# Altium project Guitar_Synth_Pedal_Rev3.PrjPcb (part 1 of 2)
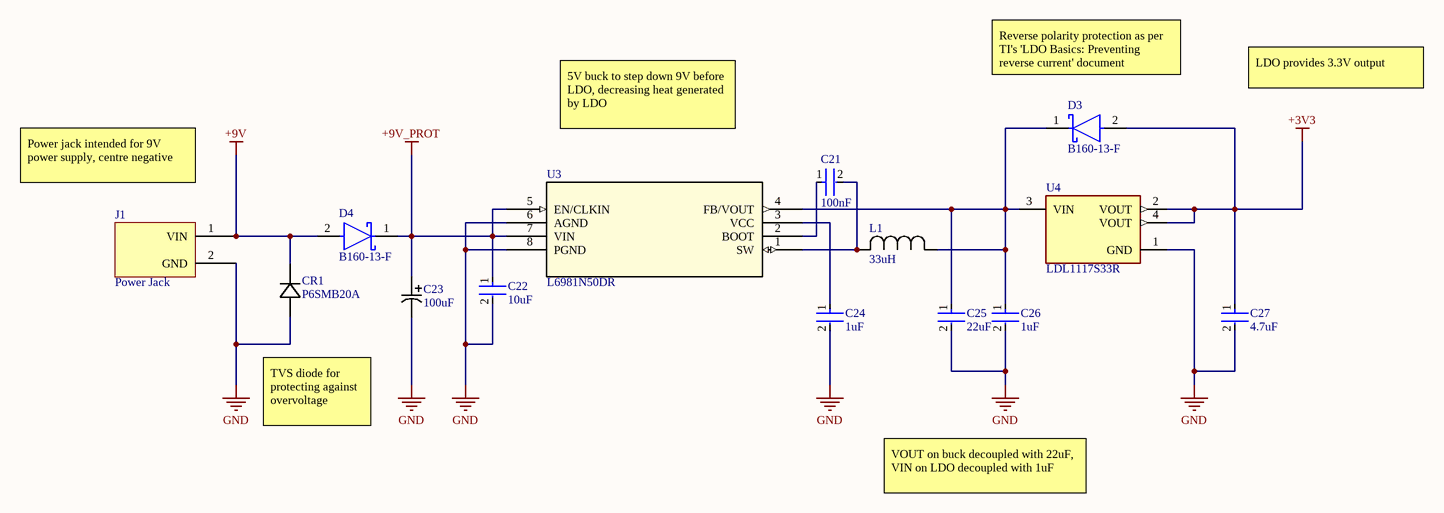
[diagram p0: Board Power.SchDoc]
Author: Leo Chinchilla; Revision: 3
7 sheets, 109 parts. Net scope: flat (ports and power ports of the same name join across sheets).
Board file: PCB1.PcbDoc
Sheets:
  Board Power.SchDoc
  Analog Input.SchDoc
  Master Control.SchDoc
  Preset Selection.SchDoc
  Analog Output.SchDoc
  MCU Power.SchDoc
  MCU IOs.SchDoc

## Sheet Board Power.SchDoc: Board Power
size A4; SheetNumber: 1; SheetTotal: 5

### Parts
C21  100nF  [FP-CC0603-DA-MFG]
C22  10uF  [FP-GRM188-0_2-IPC_A]
C23  100uF  [CAP_EEFK_D8_PAN]
C24  1uF  [FP-CC0603-DA-MFG]
C25  22uF  [FP-GRM188-0_2-IPC_A]
C26  1uF  [FP-CC0603-DA-MFG]
C27  4.7uF  [FP-CC0603-DA-MFG]
CR1  P6SMB20A  [P6SMBSeries_LTF]
D3  B160-13-F  [FP-SMA-MFG]
D4  B160-13-F  [FP-SMA-MFG]
J1  Power Jack  [PowerJack]
L1  33uH  [IND_PCC-M0630M-LP_PAN]
U3  L6981N50DR  [SO8L_L6981N33DR_STM]
U4  LDL1117S33R  [FP-SOT223-0046067-IPC_C]

### Nets
+3V3: C27.1 D3.2(A) U4.2(VOUT) U4.4(VOUT)
+9V: CR1.1 D4.2(A) J1.1(VIN)
+9V_PROT: C22.1 C23.1 D4.1(C) U3.5(EN/CLKIN) U3.7(VIN)
GND: C22.2 C23.2 C24.2 C25.2 C26.2 C27.2 CR1.2 J1.2(GND) U3.6(AGND) U3.8(PGND) U4.1(GND)
NetC21_1: C21.1 U3.2(BOOT)
NetC21_2: C21.2 L1.2 U3.1(SW)
NetC24_1: C24.1 U3.3(VCC)
NetC25_1: C25.1 C26.1 D3.1(C) L1.1 U3.4(FB/VOUT) U4.3(VIN)

### Notes on the sheet
- 5V buck to step down 9V before LDO, decreasing heat generated by LDO
- Reverse polarity protection as per TI's 'LDO Basics: Preventing reverse current' document
- LDO provides 3.3V output
- Power jack intended for 9V power supply, centre negative
- TVS diode for protecting against overvoltage
- VOUT on buck decoupled with 22uF, VIN on LDO decoupled with 1uF

### Library data of the parts
C21 = CMP-03422-000081-1: CC0603 100 nF X7R 10.00% 25 V; Manufacturer Part Number: CC0603KPX7R8BB104; Manufacturer: YAGEO; Voltage: 25 V; Material: Ceramic; Tolerance: 0.1; Temperature Coefficient: 15%; Package: CC0603-DA; Capacitance: 100 nF; Device Class L2: Capacitors; Temperature Range High: +125°C; Automotive: No; Temperature Range Low: -55°C; Value: 100 nF; Device Class L1: Passive Components; Height: 0.9mm; RoHS: TRUE; Mouser Description: Multilayer Ceramic Capacitors MLCC - SMD/SMT 100nF 25V X7R 10%; Temperature Characteristic: X7R; Footprint Url: http://www.yageo.com/exep/pages/download/literatures/UPY-C_GEN_24.pdf; Octopart: https://octopart.com/cc0603kpx7r8bb104-yageo-12885111; Category: Cap; ComponentLink2Description: Datasheet; Voltage Rating: 25 V; Temperature: -55°C to +125°C; Device Class L3: Ceramic Capacitors; ComponentLink2URL: http://www.yageo.com/documents/recent/UPY-GPHC_X7R_6.3V-to-50V_18.pdf; Lead Free: Yes
C22 = CMP-06035-045268-1: Chip Multilayer Ceramic Capacitors for General Purpose, 0603, 10uF, X5R, 15%, 10%, 25V; Case/Package: 0603
C23 = EEE-FTH101XAP: Description; Manufacturer_Name: Panasonic; Copyright: Copyright (C) 2026 Ultra Librarian. All rights reserved.; Manufacturer_Part_Number: EEE-FTH101XAP
C24 C26 = CMP-2100-03598-2: CAP CER 1UF 25V X7R 0603; Manufacturer Part Number: CC0603KRX7R8BB105; Manufacturer: YAGEO; Tolerance: 0.1; Temperature Coefficient: 15%; Material: Ceramic; Value: 1 uF; ComponentLink2URL: http://www.yageo.com/documents/recent/UPY-GPHC_X7R_6.3V-to-50V_18.pdf; Temperature Range Low: -55°C; Temperature Range High: +125°C; Device Class L3: Ceramic Capacitors; Voltage: 25 V; Voltage Rating: 25 V; Capacitance: 1 uF; Mouser Description: 0603 1 uF 25 V ±10% Tolerance X7R SMT Multilayer Ceramic Capacitor; Footprint Url: http://www.yageo.com/exep/pages/download/literatures/UPY-C_GEN_24.pdf; Height: 0.9mm; Digikey Description: CAP CER 1UF 25V X7R 0603; Temperature: -55°C to +125°C; ComponentLink2Description: Datasheet; Device Class L2: Capacitors; Category: Cap; Lead Free: Yes; Octopart: https://octopart.com/cc0603krx7r8bb105-yageo-24490981; RoHS: TRUE; Package: CC0603-DA; Device Class L1: Passive Components; Temperature Characteristic: X7R; Automotive: No
C25 = CMP-06035-063651-1: Multilayer Ceramic Capacitor 22uF 20% 16V X5R 0603 Paper T/R
C27 = CMP-03422-001217-1: CAP CER 4.7UF 25V X5R 0603; Manufacturer: YAGEO; Manufacturer Part Number: CC0603KRX5R8BB475; Material: Ceramic; Temperature Coefficient: 15%; Tolerance: 0.1; Device Class L1: Passive Components; Temperature: -55°C to +125°C; Value: 4.7 uF; RoHS: TRUE; Temperature Range High: +125°C; Automotive: No; Lead Free: Yes; Digikey Description: CAP CER 4.7UF 25V X5R 0603; Category: Cap; Temperature Characteristic: X5R; Package: CC0603-DA; Device Class L2: Capacitors; Temperature Range Low: -55°C; Voltage Rating: 25 V; Capacitance: 4.7 uF; ComponentLink2URL: http://www.yageo.com/documents/recent/UPY-GPHC_X7R_6.3V-to-50V_18.pdf; Octopart: https://octopart.com/cc0603krx5r8bb475-yageo-77825350; Footprint Url: http://www.yageo.com/exep/pages/download/literatures/UPY-C_GEN_24.pdf; Device Class L3: Ceramic Capacitors; ComponentLink2Description: Datasheet; Voltage: 25 V; Height: 0.9mm
CR1 = P6SMB20A: Description; Manufacturer_Name: Littelfuse Inc; Copyright: Copyright (C) 2025 Ultra Librarian. All rights reserved.; Manufacturer_Part_Number: P6SMB20A
D3 D4 = CMP-2000-05885-2: DIODE SCHOTTKY 60V 1A SMA; Polarity: Standard; Element Configuration: Single; Peak Reverse Current: 500uA; Capacitance: 110pF; Peak Non-Repetitive Surge Current: 30A; Forward Voltage: 700mV; Termination: SMD/SMT; Radiation Hardening: No; Number of Pins: 2; Packaging: Tape and Reel; Length: 4.6mm; Current Rating: 1A; Lead Free: Lead Free; Output Current: 1A; Max Operating Temperature: 150°C; Min Operating Temperature: -65°C; Forward Current: 1A; Mount: Surface Mount; Width: 2.92mm; Average Rectified Current: 1A; Max Forward Surge Current (Ifsm): 30A; Voltage Rating (DC): 60V; Height: 2.1mm; REACH SVHC: No SVHC; Max Reverse Voltage (DC): 60V; Max Repetitive Reverse Voltage (Vrrm): 60V; Weight: 0.002258oz; Contact Plating: Tin; Case/Package: SMA; Package Quantity: 5000
L1 = ETQ-P3M330KVN: Description; Manufacturer_Name: Panasonic; Copyright: Copyright (C) 2026 Ultra Librarian. All rights reserved.; Manufacturer_Part_Number: ETQ-P3M330KVN
U3 = L6981N50DR: 38 V, 1.5 A synchronous step-down converter with 20 &#181;A quiescent current; Manufacturer_Name: STMicroelectronics; Copyright: Copyright (C) 2025 Ultra Librarian. All rights reserved.; Manufacturer_Part_Number: L6981N50DR; RefDes: RefDes; Type: Type
U4 = CMP-12153-000006-1: IC REG LINEAR 3.3V 1.2A SOT223; Manufacturer: STMicroelectronics; Output Type: Fixed; Min Supply Voltage: 2.6V; Number Of Outputs: 1; Dropout Voltage: 350mV; Output Current: 2A; Nominal Supply Current: 250uA; Standoff Height: 0.02mm; Max Supply Voltage: 18V; Max Junction Temp: +125°C; Accuracy Percentage: 2%; Automotive: No; Device Class L2: Power Management ICs; Height: 1.9mm; Octopart: https://octopart.com/ldl1117s33r-stmicroelectronics-81876163; Output Voltage: 3.3V; Package: SOT223-0046067; Lead Free: Yes; Temperature Range Low: -40°C; Category: IC; Device Class L1: Integrated Circuits (ICs); Ipc Land Pattern Name: SOT230P700X190-4; Mouser Description: LDL1117 Series 1.2 A 3.3 V High PSRR LDO Linear Voltage Regulator-SOT-223; ComponentLink2Description: Datasheet; ComponentLink2URL: https://www.st.com/resource/en/datasheet/ldl1117.pdf; Device Class L3: Voltage Regulators - Linear; Manufacturer Part Number: LDL1117S33R; Temperature Range High: +125°C; Digikey Description: IC REG LINEAR 3.3V 1.2A SOT223; Temperature: -40°C to +125°C; RoHS: TRUE

## Sheet Analog Input.SchDoc: Analog Input
size A4; SheetNumber: 2; SheetTotal: 5
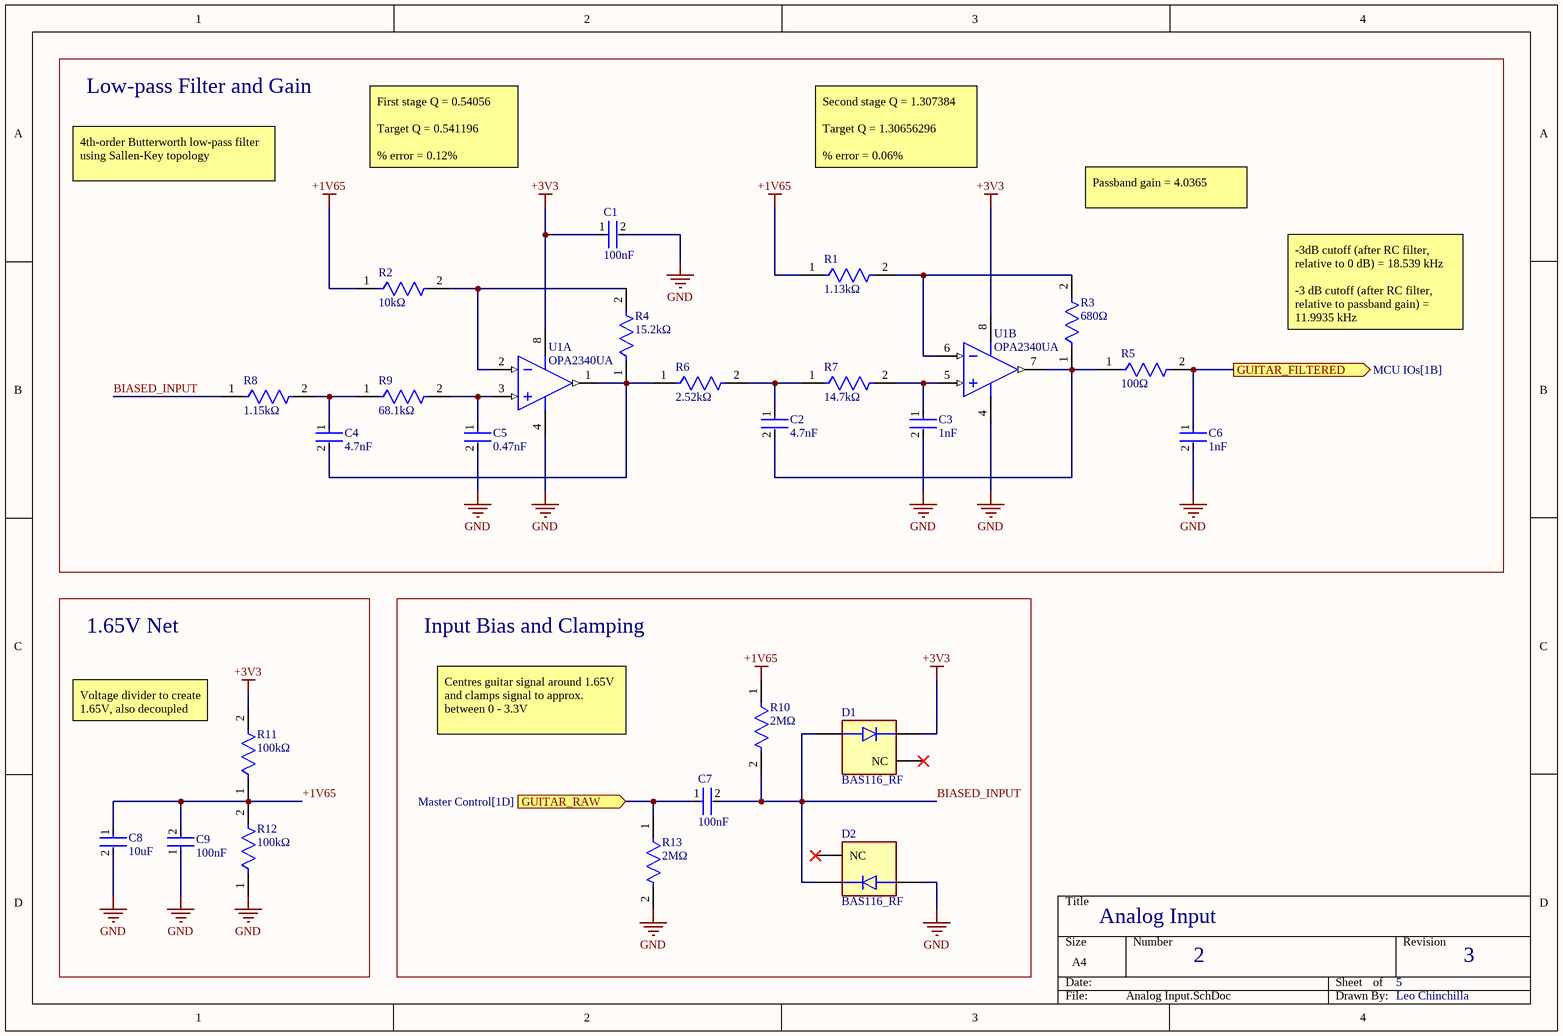
[diagram p1: Analog Input.SchDoc]

### Parts
(Parts that share a designator on the sheet are numbered #1, #2 ... from top to bottom, then left to right.)
C1  100nF  [FP-CC0603-DA-MFG]
C2  4.7nF  [FP-C0603C-CF-MFG]
C3  1nF  [FP-C0603C-CF-MFG]
C4  4.7nF  [FP-C0603C-CF-MFG]
C5  0.47nF  [FP-C0603C-CF-MFG]
C6  1nF  [FP-C0603C-CF-MFG]
C7  100nF  [FP-C1206C104F3GAC-MFG]
C8  10uF  [FP-CC0603-DC-MFG]
C9  100nF  [FP-CC0603-DA-MFG]
D1  BAS116_RF  [SOT95P237X112-3N]
D2  BAS116_RF  [SOT95P237X112-3N]
R1  1.13kΩ  [FP-RN73R1J-IPC_C]
R2  10kΩ  [FP-RT0603-MFG]
R3  680Ω  [FP-RT0603-MFG]
R4  15.2kΩ  [FP-RN73R1J-IPC_C]
R5  100Ω  [FP-RT0603-MFG]
R6  2.52kΩ  [FP-TFCR0603-MFG]
R7  14.7kΩ  [FP-RT0603-MFG]
R8  1.15kΩ  [FP-RN73R1J-IPC_A]
R9#1  68.1kΩ  [FP-RT0603-MFG]
R10#1  2MΩ  [FP-AC0603-IPC_A]
R11#1  100kΩ  [FP-RQ731J-IPC_C]
R12#1  100kΩ  [FP-RQ731J-IPC_C]
R13#1  2MΩ  [FP-AC0603-IPC_A]
U1  OPA2340UA  [D0008A_L]  (parts A,B of 2)

### Blocks framed on the sheet
Low-pass Filter and Gain: C1-C6 R1-R8 R9#1 U1
1.65V Net: C8 C9 R11#1 R12#1
Input Bias and Clamping: C7 D1 D2 R10#1 R13#1

### Ports
GUITAR_FILTERED (out, see MCU IOs[1B]), GUITAR_RAW (in, see Master Control[1D])

### Nets
+1V65: C8.1 C9.2 R1.1 R2.1 R10#1.1 R11#1.1 R12#1.2
+3V3: C1.1 D1.3(K) R11#1.2 U1.8(V+)
GND: C1.2 C3.2 C5.2 C6.2 C8.2 C9.1 D2.1(A) R12#1.1 R13#1.2 U1.4(V-)
BIASED_INPUT: C7.2 D1.1(A) D2.3(K) R8.1 R10#1.2
PEDAL_IN: C7.1 R13#1.1 ; port GUITAR_RAW
NetC2_1: C2.1 R6.2 R7.1
NetC2_2: C2.2 R3.1 R5.1 U1.7(OUT_B)
NetC3_1: C3.1 R7.2 U1.5(IN_B+)
NetC4_1: C4.1 R8.2 R9#1.1
NetC4_2: C4.2 R4.1 R6.1 U1.1(OUT_A)
NetC5_1: C5.1 R9#1.2 U1.3(IN_A+)
NetC6_1: C6.1 R5.2 ; port GUITAR_FILTERED
NetR1_2: R1.2 R3.2 U1.6(IN_B-)
NetR2_2: R2.2 R4.2 U1.2(IN_A-)

Not connected (* = marked no-connect by the designer): D1 2(NC)*; D2 2(NC)*

### Notes on the sheet
- 4th-order Butterworth low-pass filter using Sallen-Key topology
- First stage Q = 0.54056
  Target Q = 0.541196
  % error = 0.12%
- Second stage Q = 1.307384
  Target Q = 1.30656296
  % error = 0.06%
- Passband gain = 4.0365
- -3dB cutoff (after RC filter, relative to 0 dB) = 18.539 kHz
  -3 dB cutoff (after RC filter, relative to passband gain) = 11.9935 kHz
- (near R11#1) Voltage divider to create 1.65V, also decoupled
- Centres guitar signal around 1.65V and clamps signal to approx. between 0 - 3.3V

### Library data of the parts
C1 C9 = CMP-03422-000081-1: as C21 on sheet Board Power; Package: CC0603-DA; Capacitance: 100 nF; Device Class L2: Capacitors; Temperature Range High: +125°C; Automotive: No; Temperature Range Low: -55°C; Value: 100 nF; Device Class L1: Passive Components; Height: 0.9mm; RoHS: TRUE; Mouser Description: Multilayer Ceramic Capacitors MLCC - SMD/SMT 100nF 25V X7R 10%; Temperature Characteristic: X7R; Footprint Url: http://www.yageo.com/exep/pages/download/literatures/UPY-C_GEN_24.pdf; Octopart: https://octopart.com/cc0603kpx7r8bb104-yageo-12885111; Category: Cap; ComponentLink2Description: Datasheet; Voltage Rating: 25 V; Temperature: -55°C to +125°C; Device Class L3: Ceramic Capacitors; ComponentLink2URL: http://www.yageo.com/documents/recent/UPY-GPHC_X7R_6.3V-to-50V_18.pdf; Lead Free: Yes
C2 C4 = CMP-1035-02200-3: CAP CER 4700PF 50V 1% NP0 0603; Manufacturer: KEMET; Manufacturer Part Number: C0603C472F5GACTU; Tolerance: 0.01; Temperature Characteristic: C0G; Capacitance: 4,700 pF; Automotive Grade: Grade 1; Temperature Coefficient: 30ppm/°C; Value: 4,700 pF; Material: Ceramic; Device Class L1: Passive Components; Device Class L3: Ceramic Capacitors; Device Class L2: Capacitors; ComponentLink2Description: Datasheet; Voltage Rating: 50 V; Package: C0603C-CF; Octopart: https://octopart.com/c0603c472f5gactu-kemet-19050072; Height: 0.87mm; Lead Free: Yes; Mouser Description: Multilayer Ceramic Capacitors MLCC - SMD/SMT 50volts 4700pF 1% C0G; Category: Cap; ComponentLink2URL: https://api.kemet.com/component-edge/download/datasheet/C0603C100J5GACAUTO.pdf; Temperature: -55°C to +125°C; Temperature Range Low: -55°C; Digikey Description: CAP CER 4700PF 50V 1% NP0 0603; RoHS: TRUE; Temperature Range High: +125°C; Automotive: Yes
C3 = CMP-03020-010881-2: CAP CER 1000PF 100V C0G/NP0 0603; Manufacturer: KEMET; Manufacturer Part Number: C0603C102F1GAC7867; Temperature Characteristic: C0G; Tolerance: 0.01; Capacitance: 1,000 pF; Value: 1,000 pF; Material: Ceramic; Automotive Grade: Grade 1; Temperature Coefficient: 30ppm/°C; RoHS: TRUE; Temperature Range High: +125°C; Octopart: https://octopart.com/c0603c102f1gac7867-kemet-25528596; ComponentLink2URL: https://api.kemet.com/component-edge/download/datasheet/C0603C100J5GACAUTO.pdf; Lead Free: Yes; ComponentLink2Description: Datasheet; Automotive: Yes; Temperature Range Low: -55°C; Device Class L3: Ceramic Capacitors; Height: 0.87mm; Device Class L2: Capacitors; Voltage Rating: 100 V; Digikey Description: CAP CER 1000PF 100V C0G/NP0 0603; Package: C0603C-CF; Device Class L1: Passive Components; Temperature: -55°C to +125°C; Category: Cap
C5 = CMP-03020-027223-2: C0603 470 pF C0G 30ppm/°C 1.00% 50 V; Manufacturer: KEMET; Manufacturer Part Number: C0603C471F5GAC; Voltage Rating: 50 V; Automotive Grade: Grade 1; Value: 470 pF; Material: Ceramic; Tolerance: 0.01; Temperature Range Low: -55°C; Height: 0.87mm; Automotive: Yes; Temperature Range High: +125°C; Temperature Characteristic: C0G; Package: C0603C-CF; Device Class L1: Passive Components; ComponentLink2Description: Datasheet; Category: Cap; RoHS: TRUE; Temperature Coefficient: 30ppm/°C; ComponentLink2URL: https://api.kemet.com/component-edge/download/datasheet/C0603C100J5GACAUTO.pdf; Device Class L3: Ceramic Capacitors; Temperature: -55°C to +125°C; Capacitance: 470 pF; Mouser Description: Cap Ceramic 470pF 50V C0G 1% Pad SMD 0603 125C Bulk; Device Class L2: Capacitors; Lead Free: Yes; Octopart: https://octopart.com/c0603c471f5gac-kemet-9143462
C6 = CMP-03020-002782-2: C0603 1,000 pF C0G 30ppm/°C 1.00% 25 V; Manufacturer Part Number: C0603C102F3GAC; Manufacturer: KEMET; Material: Ceramic; Tolerance: 0.01; Automotive Grade: Grade 1; Voltage Rating: 25 V; Height: 0.87mm; Lead Free: Yes; Capacitance: 1,000 pF; ComponentLink2URL: https://api.kemet.com/component-edge/download/datasheet/C0603C100J5GACAUTO.pdf; Device Class L3: Ceramic Capacitors; Temperature Coefficient: 30ppm/°C; Automotive: Yes; Value: 1,000 pF; Octopart: https://octopart.com/c0603c102f3gac-kemet-9143535; Device Class L2: Capacitors; Category: Cap; Mouser Description: Multilayer Ceramic Capacitors MLCC - SMD/SMT 25volts 1000pF 1% C0G; Temperature: -55°C to +125°C; ComponentLink2Description: Datasheet; Temperature Characteristic: C0G; Device Class L1: Passive Components; Temperature Range Low: -55°C; Package: C0603C-CF; RoHS: TRUE; Temperature Range High: +125°C
C7 = CMP-03020-034715-1: 0.1 µF ±1% 25V Ceramic Capacitor C0G, NP0 1206 (3216 Metric); RoHS Compliant: Yes
C8 = CMP-00621-81932632-1: CC0603KRX5R7BB106 Multilayer Ceramic Capacitor, 10 uF, 16 V, ± 10%, X5R, 0603 [1608 Metric]; Capacitance: 10µF; Voltage Rating: 16V; NexarPartId: 81932632; Height: 1mm; Halogen Free: Halogen Free; Dielectric: X5R; Max Operating Temperature: 85°C; Voltage Rating (DC): 16V; Material: Ceramic; Lead Free: Lead Free; Tolerance: 10%; RoHS: Non-Compliant; Min Operating Temperature: -55°C; Case/Package: 0603
D1 D2 = BAS116_RF: MF: {'manufacturer': u'Taiwan Semiconductor'}; MP: BAS116 RFG; Package: None; Price: None; Value: *; Availability: Unavailable
R1 = CMP-04015-024131-1: 1.13kΩ ±0.05% 0.1W, 1/10W Chip Resistor 0603 (1608 Metric) Moisture Resistant Thin Film
R2 = CMP-03412-024743-1: RES SMD 10K OHM 0.05% 1/10W 0603; Manufacturer: Yageo; Manufacturer Part Number: RT0603WRE0710KL; Power Rating: 0.1W; Voltage Rating: 75V; Tolerance: 0.0005; Temperature Coefficient: 50 ppm/°C; Height: 0.55mm; ComponentLink2URL: http://www.yageo.com/documents/recent/PYu-RT_1-to-0.01_RoHS_L_9.pdf; Mouser Description: Res SMD 10K Ohm 0.05% 1/10W 0603; Device Class L1: Passive Components; Octopart: https://octopart.com/rt0603wre0710kl-yageo-71396825; Lead Free: Yes; RoHS: TRUE; ComponentLink2Description: Datasheet; Package: RT0603; Ipc Land Pattern Name: RESC16080X45; Automotive: No; Temperature: -55°C to +155°C; Value: 10KΩ; Series: RT; Resistance: 10KΩ; Footprint Url: http://www.yageo.com/exep/pages/download/literatures/PYu-R_Mount_10.pdf; Temperature Range Low: -55°C; Digikey Description: RES SMD 10K OHM 0.05% 1/10W 0603; Category: Res; Device Class L3: Chip SMD Resistors; Temperature Range High: +155°C; Device Class L2: Resistors; Composition: Thin Film
R3 = CMP-03412-028845-1: RES SMD 680 OHM 0.05% 1/10W 0603; Manufacturer: Yageo; Manufacturer Part Number: RT0603WRD07680RL; Voltage Rating: 75V; Power Rating: 0.1W; Tolerance: 0.0005; Temperature Coefficient: 25 ppm/°C; Package: RT0603; Value: 680Ω; Resistance: 680Ω; RoHS: TRUE; Octopart: https://octopart.com/rt0603wrd07680rl-yageo-71396736; Digikey Description: RES SMD 680 OHM 0.05% 1/10W 0603; Ipc Land Pattern Name: RESC16080X45; Height: 0.55mm; Device Class L1: Passive Components; Series: RT; Temperature: -55°C to +155°C; Temperature Range High: +155°C; Temperature Range Low: -55°C; Lead Free: Yes; Composition: Thin Film; ComponentLink2URL: http://www.yageo.com/documents/recent/PYu-RT_1-to-0.01_RoHS_L_9.pdf; ComponentLink2Description: Datasheet; Footprint Url: http://www.yageo.com/exep/pages/download/literatures/PYu-R_Mount_10.pdf; Device Class L3: Chip SMD Resistors; Automotive: No; Category: Res; Device Class L2: Resistors
R4 = CMP-04015-019747-1: 15.2kΩ ±0.05% 0.1W, 1/10W Chip Resistor 0603 (1608 Metric) Moisture Resistant Thin Film
R5 = CMP-2000-04516-2: RES SMD 100 OHM 0.1% 1/10W 0603; Manufacturer: Yageo; Manufacturer Part Number: RT0603BRE07100RL; Temperature Coefficient: 50 ppm/°C; Power Rating: 0.1W; Voltage Rating: 75V; Tolerance: 0.001; Value: 100Ω; Lead Free: Yes; Ipc Land Pattern Name: RESC16080X45; Resistance: 100Ω; Package: RT0603; Device Class L1: Passive Components; Temperature Range High: +155°C; Height: 0.55mm; Automotive: No; Octopart: https://octopart.com/rt0603bre07100rl-yageo-1483384; Composition: Thin Film; Device Class L2: Resistors; Device Class L3: Chip SMD Resistors; Series: RT; Digikey Description: RES SMD 100 OHM 0.1% 1/10W 0603; RoHS: TRUE; ComponentLink2URL: http://www.yageo.com/documents/recent/PYu-RT_1-to-0.01_RoHS_L_9.pdf; Temperature Range Low: -55°C; Category: Res; Footprint Url: http://www.yageo.com/exep/pages/download/literatures/PYu-R_Mount_10.pdf; ComponentLink2Description: Datasheet; Temperature: -55°C to +155°C
R6 = CMP-250906-113146-1: RES Thin Film,  2.52kΩ, 0.1%, 0.1W, 50ppm/°C, 0603
R7 = CMP-03412-019103-1: RES SMD 14.7K OHM 1/10W 0603; Manufacturer Part Number: RT0603WRD0714K7L; Manufacturer: Yageo; Tolerance: 0.0005; Voltage Rating: 75V; Power Rating: 0.1W; Temperature Coefficient: 25 ppm/°C; Height: 0.55mm; Category: Res; Automotive: No; Footprint Url: http://www.yageo.com/exep/pages/download/literatures/PYu-R_Mount_10.pdf; Composition: Thin Film; ComponentLink2URL: http://www.yageo.com/documents/recent/PYu-RT_1-to-0.01_RoHS_L_9.pdf; Temperature: -55°C to +155°C; Temperature Range Low: -55°C; Lead Free: Yes; Series: RT; Temperature Range High: +155°C; Ipc Land Pattern Name: RESC16080X45; RoHS: TRUE; Resistance: 14.7KΩ; Digikey Description: RES SMD 14.7K OHM 1/10W 0603; Value: 14.7KΩ; Octopart: https://octopart.com/rt0603wrd0714k7l-yageo-71396410; Package: RT0603; ComponentLink2Description: Datasheet; Device Class L2: Resistors; Device Class L1: Passive Components; Device Class L3: Chip SMD Resistors
R8 = CMP-04015-014252-1: 1.15kΩ ±0.05% 0.1W, 1/10W Chip Resistor 0603 (1608 Metric) Moisture Resistant Thin Film
R9#1 = CMP-03412-006240-1: RES SMD 68.1K OHM 1/10W 0603; Manufacturer Part Number: RT0603WRE0768K1L; Manufacturer: Yageo; Temperature Coefficient: 50 ppm/°C; Tolerance: 0.0005; Power Rating: 0.1W; Voltage Rating: 75V; Height: 0.55mm; Footprint Url: http://www.yageo.com/exep/pages/download/literatures/PYu-R_Mount_10.pdf; Package: RT0603; Octopart: https://octopart.com/rt0603wre0768k1l-yageo-71397197; Device Class L3: Chip SMD Resistors; Device Class L2: Resistors; ComponentLink2URL: http://www.yageo.com/documents/recent/PYu-RT_1-to-0.01_RoHS_L_9.pdf; Ipc Land Pattern Name: RESC16080X45; Temperature Range High: +155°C; ComponentLink2Description: Datasheet; Value: 68.1KΩ; Resistance: 68.1KΩ; Digikey Description: RES SMD 68.1K OHM 1/10W 0603; Category: Res; Temperature Range Low: -55°C; Temperature: -55°C to +155°C; Composition: Thin Film; Device Class L1: Passive Components; Automotive: No; Series: RT; RoHS: TRUE; Lead Free: Yes
R10#1 R13#1 = CMP-03412-049830-1: RES 2MΩ 0.50% 0.1W 0603
R11#1 R12#1 = CMP-03211-001316-1: RQ73 0603 100KΩ  0.15W 10ppm/°C 0.1% 75V; Manufacturer: TE; Manufacturer Part Number: RQ73C1J100KBTD; Automotive Grade: Grade 0; Device Class L3: Chip SMD Resistors; Composition: Thin Film; Category: Res; Device Class L2: Resistors; Automotive: Yes; Temperature Range High: +155°C; Resistance: 100KΩ; Octopart: https://octopart.com/rq73c1j100kbtd-te+connectivity-93908182; Temperature Range Low: -55°C; Device Class L1: Passive Components; Tolerance: 0.1%; ComponentLink2Description: Datasheet; Temperature: -55°C to +155°C; Value: 100KΩ; Ipc Land Pattern Name: RESC15580X45; Series: RQ73; Package: RQ731J; ComponentLink2URL: https://www.te.com/commerce/DocumentDelivery/DDEController?Action=showdoc&DocId=Data+Sheet%7F1773270-2%7FA%7Fpdf%7FEnglish%7FENG_DS_1773270-2_A.pdf%7F4-2176362-2; Height: 0.6mm; Power Rating: 0.15W; Lead Free: Yes; Temperature Coefficient: 10ppm/°C; Voltage Rating: 75V; RoHS: TRUE
U1 = CMP-0272-00784-3: Single-Supply, Rail-to-Rail Operational Amplifier MicroAmplifier(TM) Series, 2.5 to 5.5 V, -40 to 85 degC, 8-pin SOIC (D8), Green (RoHS & no Sb/Br); Manufacturer: Texas Instruments; Iq per channel(Max)(mA): 0.95; CMRR(Min)(dB): 80; Slew Rate(Typ)(V/us): 6; Vio (25C)(Max)(mV): 0.5; IIB(Max)(pA): 10; Number of Channels: 2; Sub Family: Low Input Bias Current Amp (<=10pA), Low Offset Voltage Amplifier (<=500uV), Low Supply Voltage Amplifier (<=2.7V), Precision Amplifier; Offset Drift(Typ)(uV/C): 2.5; Vn at 1kHz(Typ)(nV/rtHz): 25; Total Supply Voltage(Max)(+5V is 5, +/-5V is 10): 5.5; Eco-Plan: Green (RoHS & no Sb/Br); PackageDescription: 8-Pin Plastic Small Outline, Body 4.9 x 3.9 mm, Pitch 1.27 mm; Code_JEDEC: MS-012; PartNumber: OPA2340UA; ComponentLink1URL: http://www.ti.com/; Mounting Technology: Surface Mount; ComponentLink1Description: Manufacturer URL; PackageReference: D0008A; ComponentLink2URL: http://www.ti.com/general/docs/lit/getliterature.tsp?genericPartNumber=OPA2340&fileType=pdf; ComponentLink2Description: Datasheet; ComponentLink3Description: Package Specification; PackageVersion: 4040047-3/M, 06/2011; Total Supply Voltage(Min)(+5V is 5, +/-5V is 10): 2.5; DatasheetVersion: SBOS073B; ComponentLink3URL: http://www.ti.com/litv/pdf/msoi002j

## Sheet Master Control.SchDoc: Master Control
size A4; SheetNumber: 6; SheetTotal: 5
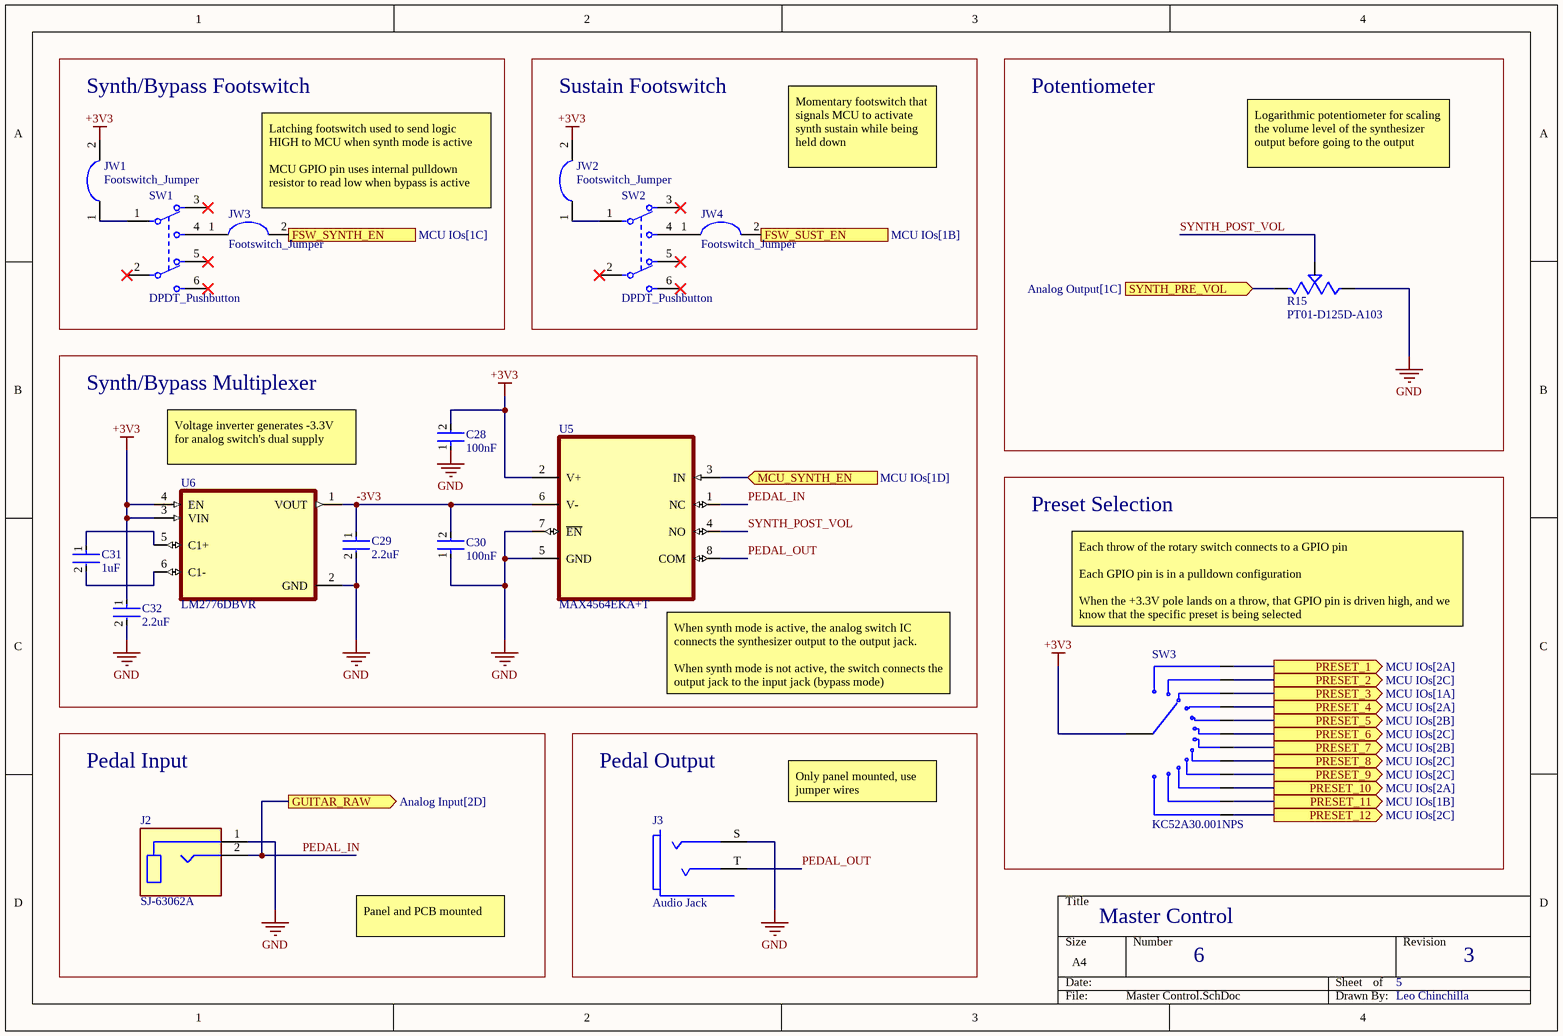
[diagram p2: Master Control.SchDoc]

### Parts
(Parts that share a designator on the sheet are numbered #1, #2 ... from top to bottom, then left to right.)
C28  100nF  [FP-CC0603-DA-MFG]
C29  2.2uF  [FP-CC0603-DA-MFG]
C30  100nF  [FP-CC0603-DA-MFG]
C31  1uF  [FP-CC0603-DA-MFG]
C32  2.2uF  [FP-CC0603-DA-MFG]
J2  SJ-63062A  [CUI_SJ-63062A]
J3  Audio Jack  [AudioJack]
JW1  Footswitch_Jumper  [Footswitch_Jumper]
JW2  Footswitch_Jumper  [Footswitch_Jumper]
JW3  Footswitch_Jumper  [Footswitch_Jumper]
JW4  Footswitch_Jumper  [Footswitch_Jumper]
R15#1  PT01-D125D-A103  [TRIM_PT01-D125D-A103]
SW1  DPDT_Pushbutton  [DPDT_Pushbutton]
SW2#1  DPDT_Pushbutton  [DPDT_Pushbutton]
SW3  KC52A30.001NPS  [SW_KC52A30.001NPS]
U5  MAX4564EKA+T  [SOT65P280X145-8N]
U6  LM2776DBVR  [SOT95P280X145-6N]

### Blocks framed on the sheet
Synth/Bypass Footswitch: JW1 JW3 SW1
Sustain Footswitch: JW2 JW4 SW2#1
Potentiometer: R15#1
Synth/Bypass Multiplexer: C28-C32 U5 U6
Preset Selection: SW3
Pedal Input: J2
Pedal Output: J3

### Ports
FSW_SUST_EN (out, see MCU IOs[1B]), FSW_SYNTH_EN (out, see MCU IOs[1C]), GUITAR_RAW (out, see Analog Input[2D]), MCU_SYNTH_EN (in, see MCU IOs[1D]), PRESET_1 (out, see MCU IOs[2A]), PRESET_2 (out, see MCU IOs[2C]), PRESET_3 (out, see MCU IOs[1A]), PRESET_4 (out, see MCU IOs[2A]), PRESET_5 (out, see MCU IOs[2B]), PRESET_6 (out, see MCU IOs[2C]), PRESET_7 (out, see MCU IOs[2B]), PRESET_8 (out, see MCU IOs[2C]), PRESET_9 (out, see MCU IOs[2C]), PRESET_10 (out, see MCU IOs[2A]), PRESET_11 (out, see MCU IOs[1B]), PRESET_12 (out, see MCU IOs[2C]), SYNTH_PRE_VOL (in, see Analog Output[1C])

### Nets
+3V3: C28.2 C32.1 JW1.2 JW2.2 SW3.A U5.2(V+) U6.3(VIN) U6.4(EN)
GND: C28.1 C29.2 C30.1 C32.2 J2.1(SLEEVE) J3.S R15#1.3 U5.5(GND) U5.7(~{EN}) U6.2(GND)
-3V3: C29.1 C30.2 U5.6(V-) U6.1(VOUT)
PEDAL_IN: J2.2(TIP) U5.1(NC) ; port GUITAR_RAW
PEDAL_OUT: J3.T U5.8(COM)
SYNTH_POST_VOL: R15#1.2 U5.4(NO)
NetC20_1: R15#1.1 ; port SYNTH_PRE_VOL
NetC31_1: C31.1 U6.5(C1+)
NetC31_2: C31.2 U6.6(C1-)
NetJW1_1: JW1.1 SW1.1(1_C)
NetJW2_1: JW2.1 SW2#1.1(1_C)
NetJW3_1: JW3.1 SW1.4(1_NO)
NetJW3_2: JW3.2 ; port FSW_SYNTH_EN
NetJW4_1: JW4.1 SW2#1.4(1_NO)
NetJW4_2: JW4.2 ; port FSW_SUST_EN
NetSW3_1: SW3.1 ; port PRESET_1
NetSW3_2: SW3.2 ; port PRESET_2
NetSW3_3: SW3.3 ; port PRESET_3
NetSW3_4: SW3.4 ; port PRESET_4
NetSW3_5: SW3.5 ; port PRESET_5
NetSW3_6: SW3.6 ; port PRESET_6
NetSW3_7: SW3.7 ; port PRESET_7
NetSW3_8: SW3.8 ; port PRESET_8
NetSW3_9: SW3.9 ; port PRESET_9
NetSW3_10: SW3.10 ; port PRESET_10
NetSW3_11: SW3.11 ; port PRESET_11
NetSW3_12: SW3.12 ; port PRESET_12
NetU5_3: U5.3(IN) ; port MCU_SYNTH_EN

Not connected (* = marked no-connect by the designer): SW1 2(2_C)* 3(1_NC)* 5(2_NC)* 6(2_NO)*; SW2#1 2(2_C)* 3(1_NC)* 5(2_NC)* 6(2_NO)*

### Notes on the sheet
- Momentary footswitch that signals MCU to activate synth sustain while being held down
- Logarithmic potentiometer for scaling the volume level of the synthesizer output before going to the output
- (near JW3) Latching footswitch used to send logic HIGH to MCU when synth mode is active
  MCU GPIO pin uses internal pulldown resistor to read low when bypass is active
- (near U6) Voltage inverter generates -3.3V for analog switch's dual supply
- (near SW3) Each throw of the rotary switch connects to a GPIO pin
  Each GPIO pin is in a pulldown configuration
  When the +3.3V pole lands on a throw, that GPIO pin is driven high, and we know that the specific preset is being selected
- When synth mode is active, the analog switch IC connects the synthesizer output to the output jack.
  When synth mode is not active, the switch connects the output jack to the input jack (bypass mode)
- Only panel mounted, use jumper wires
- Panel and PCB mounted

### Library data of the parts
C28 C30 = CMP-03422-000081-1: as C21 on sheet Board Power; Package: CC0603-DA; Capacitance: 100 nF; Device Class L2: Capacitors; Temperature Range High: +125°C; Automotive: No; Temperature Range Low: -55°C; Value: 100 nF; Device Class L1: Passive Components; Height: 0.9mm; RoHS: TRUE; Mouser Description: Multilayer Ceramic Capacitors MLCC - SMD/SMT 100nF 25V X7R 10%; Temperature Characteristic: X7R; Footprint Url: http://www.yageo.com/exep/pages/download/literatures/UPY-C_GEN_24.pdf; Octopart: https://octopart.com/cc0603kpx7r8bb104-yageo-12885111; Category: Cap; ComponentLink2Description: Datasheet; Voltage Rating: 25 V; Temperature: -55°C to +125°C; Device Class L3: Ceramic Capacitors; ComponentLink2URL: http://www.yageo.com/documents/recent/UPY-GPHC_X7R_6.3V-to-50V_18.pdf; Lead Free: Yes
C29 C32 = CMP-03422-001238-1: CAP CER 2.2UF 16V X7R 0603; Manufacturer: YAGEO; Manufacturer Part Number: CC0603KRX7R7BB225; Temperature Coefficient: 15%; Material: Ceramic; Tolerance: 0.1; Voltage: 16 V; Temperature Range High: +125°C; Digikey Description: CAP CER 2.2UF 16V X7R 0603; Temperature: -55°C to +125°C; Value: 2.2 uF; Lead Free: Yes; Capacitance: 2.2 uF; Package: CC0603-DA; ComponentLink2URL: http://www.yageo.com/documents/recent/UPY-GPHC_X7R_6.3V-to-50V_18.pdf; Device Class L1: Passive Components; Category: Cap; ComponentLink2Description: Datasheet; Mouser Description: Cap Ceramic 2.2uF 16V X7R 10% Pad SMD 0603 125C Automotive T/R; Device Class L2: Capacitors; RoHS: TRUE; Automotive: No; Voltage Rating: 16 V; Device Class L3: Ceramic Capacitors; Temperature Range Low: -55°C; Height: 0.9mm; Footprint Url: http://www.yageo.com/exep/pages/download/literatures/UPY-C_GEN_24.pdf; Temperature Characteristic: X7R; Octopart: https://octopart.com/cc0603krx7r7bb225-yageo-67146440
C31 = CMP-2100-03598-2: as C24 on sheet Board Power; Value: 1 uF; ComponentLink2URL: http://www.yageo.com/documents/recent/UPY-GPHC_X7R_6.3V-to-50V_18.pdf; Temperature Range Low: -55°C; Temperature Range High: +125°C; Device Class L3: Ceramic Capacitors; Voltage: 25 V; Voltage Rating: 25 V; Capacitance: 1 uF; Mouser Description: 0603 1 uF 25 V ±10% Tolerance X7R SMT Multilayer Ceramic Capacitor; Footprint Url: http://www.yageo.com/exep/pages/download/literatures/UPY-C_GEN_24.pdf; Height: 0.9mm; Digikey Description: CAP CER 1UF 25V X7R 0603; Temperature: -55°C to +125°C; ComponentLink2Description: Datasheet; Device Class L2: Capacitors; Category: Cap; Lead Free: Yes; Octopart: https://octopart.com/cc0603krx7r8bb105-yageo-24490981; RoHS: TRUE; Package: CC0603-DA; Device Class L1: Passive Components; Temperature Characteristic: X7R; Automotive: No
J2 = SJ-63062A: 6.35 mm, Mono, Right Angle, Through Hole, 2 Conductors, 0 Internal Switches, Audio Jack Connector; MF: Same Sky; SnapEDA_Link: https://www.snapeda.com/parts/SJ-63062A/Same+Sky/view-part/?ref=snap; Package: None; Value: *; MP: SJ-63062A; Check_prices: https://www.snapeda.com/parts/SJ-63062A/Same+Sky/view-part/?ref=eda
J3 = Audio Jack: PJ-629HAN-05
R15#1 = PT01-D125D-A103: 10 mm, Vertical, Logarithmic, 10 kÎ©, Through Hole, D-cut Rotary Potentiometer; MF: Same Sky; SnapEDA_Link: https://www.snapeda.com/parts/PT01-D125D-A103/Same+Sky/view-part/?ref=snap; Package: None; Value: *; MP: PT01-D125D-A103; Check_prices: https://www.snapeda.com/parts/PT01-D125D-A103/Same+Sky/view-part/?ref=eda
SW1 = DPDT_Pushbutton: ST61L-P
SW2#1 = DPDT_Pushbutton: PBS24212P
SW3 = KC52A30.001NPS: Rotary Switch 12 Position SP12T 350mA (AC) 125 VAC Panel Mount, Through Hole; MF: E-Switch; Availability: In Stock; SnapEDA_Link: https://www.snapeda.com/parts/KC52A30.001NPS/E-Switch/view-part/?ref=snap; Check_prices: https://www.snapeda.com/parts/KC52A30.001NPS/E-Switch/view-part/?ref=eda; Price: None; Package: None; Purchase-URL: https://pricing.snapeda.com/search/part/KC52A30.001NPS/?ref=eda; MP: KC52A30.001NPS; Value: *
U5 = MAX4564EKA+T: Low-Voltage, Dual-Supply, SPDT Analog Switch with Enable; MF: Analog Devices; SnapEDA_Link: https://www.snapeda.com/parts/MAX4564EKA+T/Analog+Devices/view-part/?ref=snap; Package: SOT-8 Maxim; Value: *; MP: MAX4564EKA+T; Check_prices: https://www.snapeda.com/parts/MAX4564EKA+T/Analog+Devices/view-part/?ref=eda
U6 = LM2776DBVR: Switched Capacitor Inverter; MF: Texas Instruments; SnapEDA_Link: https://www.snapeda.com/parts/LM2776DBVR/Texas+Instruments/view-part/?ref=snap; Package: SOT-23-6 Texas Instruments; Value: *; MP: LM2776DBVR; Check_prices: https://www.snapeda.com/parts/LM2776DBVR/Texas+Instruments/view-part/?ref=eda

## Sheet Preset Selection.SchDoc: Preset Selection
size A4; SheetNumber: 4; SheetTotal: 7
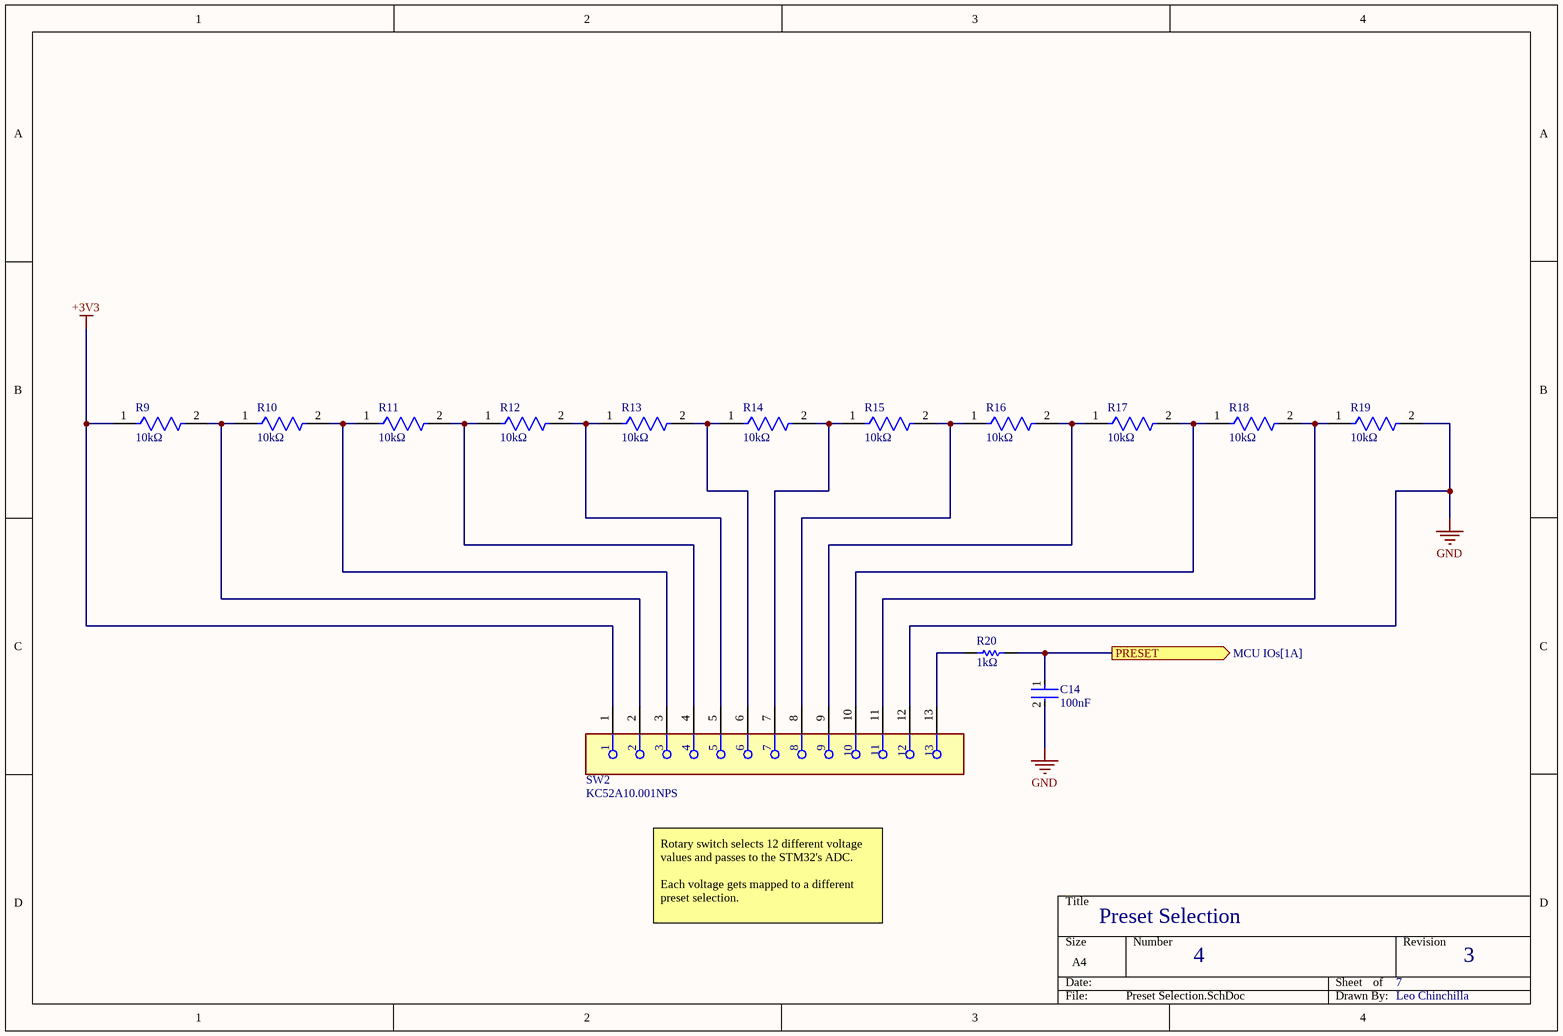
[diagram p3: Preset Selection.SchDoc]

### Parts
(Parts that share a designator on the sheet are numbered #1, #2 ... from top to bottom, then left to right.)
C14#1  100nF  [FP-C0805C-DN-MFG]
R9#2  10kΩ  [FP-MCU0805-IPC_C]
R10#2  10kΩ  [FP-MCU0805-IPC_C]
R11#2  10kΩ  [FP-MCU0805-IPC_C]
R12#2  10kΩ  [FP-MCU0805-IPC_C]
R13#2  10kΩ  [FP-MCU0805-IPC_C]
R14#1  10kΩ  [FP-MCU0805-IPC_C]
R15#2  10kΩ  [FP-MCU0805-IPC_C]
R16#1  10kΩ  [FP-MCU0805-IPC_C]
R17#1  10kΩ  [FP-MCU0805-IPC_C]
R18#1  10kΩ  [FP-MCU0805-IPC_C]
R19#1  10kΩ  [FP-MCU0805-IPC_C]
R20  1kΩ  [RESC2013X55X40ML15T20]
SW2#2  KC52A10.001NPS  [PCBComponent_1]

### Ports
PRESET (out, see MCU IOs[1A])

### Nets
+3V3: R9#2.1 SW2#2.1
GND: C14#1.2 R19#1.2 SW2#2.12
NetC14#1_1: C14#1.1 R20.2 ; port PRESET
NetR9#2_2: R9#2.2 R10#2.1 SW2#2.2
NetR10#2_2: R10#2.2 R11#2.1 SW2#2.3
NetR11#2_2: R11#2.2 R12#2.1 SW2#2.4
NetR12#2_2: R12#2.2 R13#2.1 SW2#2.5
NetR13#2_2: R13#2.2 R14#1.1 SW2#2.6
NetR14#1_2: R14#1.2 R15#2.1 SW2#2.7
NetR15#2_2: R15#2.2 R16#1.1 SW2#2.8
NetR16#1_2: R16#1.2 R17#1.1 SW2#2.9
NetR17#1_2: R17#1.2 R18#1.1 SW2#2.10
NetR18#1_2: R18#1.2 R19#1.1 SW2#2.11
NetR20_1: R20.1 SW2#2.13

### Notes on the sheet
- Rotary switch selects 12 different voltage values and passes to the STM32's ADC.
  Each voltage gets mapped to a different preset selection.

### Library data of the parts
C14#1 = CMP-03020-002348-1: CAP CER 0.1UF 50V X7R 0805; Manufacturer: KEMET; Manufacturer Part Number: C0805C104J5RACAUTO; Material: Ceramic; Tolerance: 0.05; Capacitance: 0.10 μF; Value: 0.10 μF; Temperature Coefficient: 30ppm/°C; Voltage Rating: 50 V; ComponentLink2URL: https://content.kemet.com/datasheets/KEM_C1003_C0G_SMD.pdf; Temperature Characteristic: X7R; Device Class L2: Capacitors; Ipc Land Pattern Name: CAPC200125X78; Lead Free: Yes; Device Class L1: Passive Components; Package: C0805C-DN; Temperature Range High: +125°C; Octopart: https://octopart.com/c0805c104j5racauto-kemet-22884343; Temperature: -55°C to +125°C; ComponentLink2Description: Datasheet; Height: 0.88mm; Digikey Description: CAP CER 0.1UF 50V X7R 0805; Category: Cap; Temperature Range Low: -55°C; RoHS: TRUE; Device Class L3: Ceramic Capacitors; Automotive: No
R9#2 R10#2 R11#2 R12#2 R13#2 R14#1 R15#2 R16#1 R17#1 R18#1 R19#1 = CMP-02407-010343-1: RES 1.05K OHM 0.5% 1/5W 0805; Tolerance: 0.1%; Temperature Coefficient: 10ppm/°C; Max Power Dissipation: 125mW; Resistance: 10kR; Military Standard: Not; Min Operating Temperature: -55°C; Length: 0.079inch; Composition: Thin Film; Case/Package: 0805; Package Quantity: 1000; Number of Terminations: 2; Lead Free: Lead Free; Width: 0.049inch; Depth: 1.25mm; Height: 0.022inch; Max Operating Temperature: 125°C; Packaging: Tape and Reel
R20 = CMP-2001-04687-1: Manufacturer: Vishay Dale; Part Number: TNPW08051K00BETA
SW2#2 = KC52A10.001NPS: Rotary Switch 12 Position SP12T 350mA (AC) 125 VAC Panel Mount, Through Hole

## Sheet Analog Output.SchDoc: Analog Output
size A4; SheetNumber: 6; SheetTotal: 5
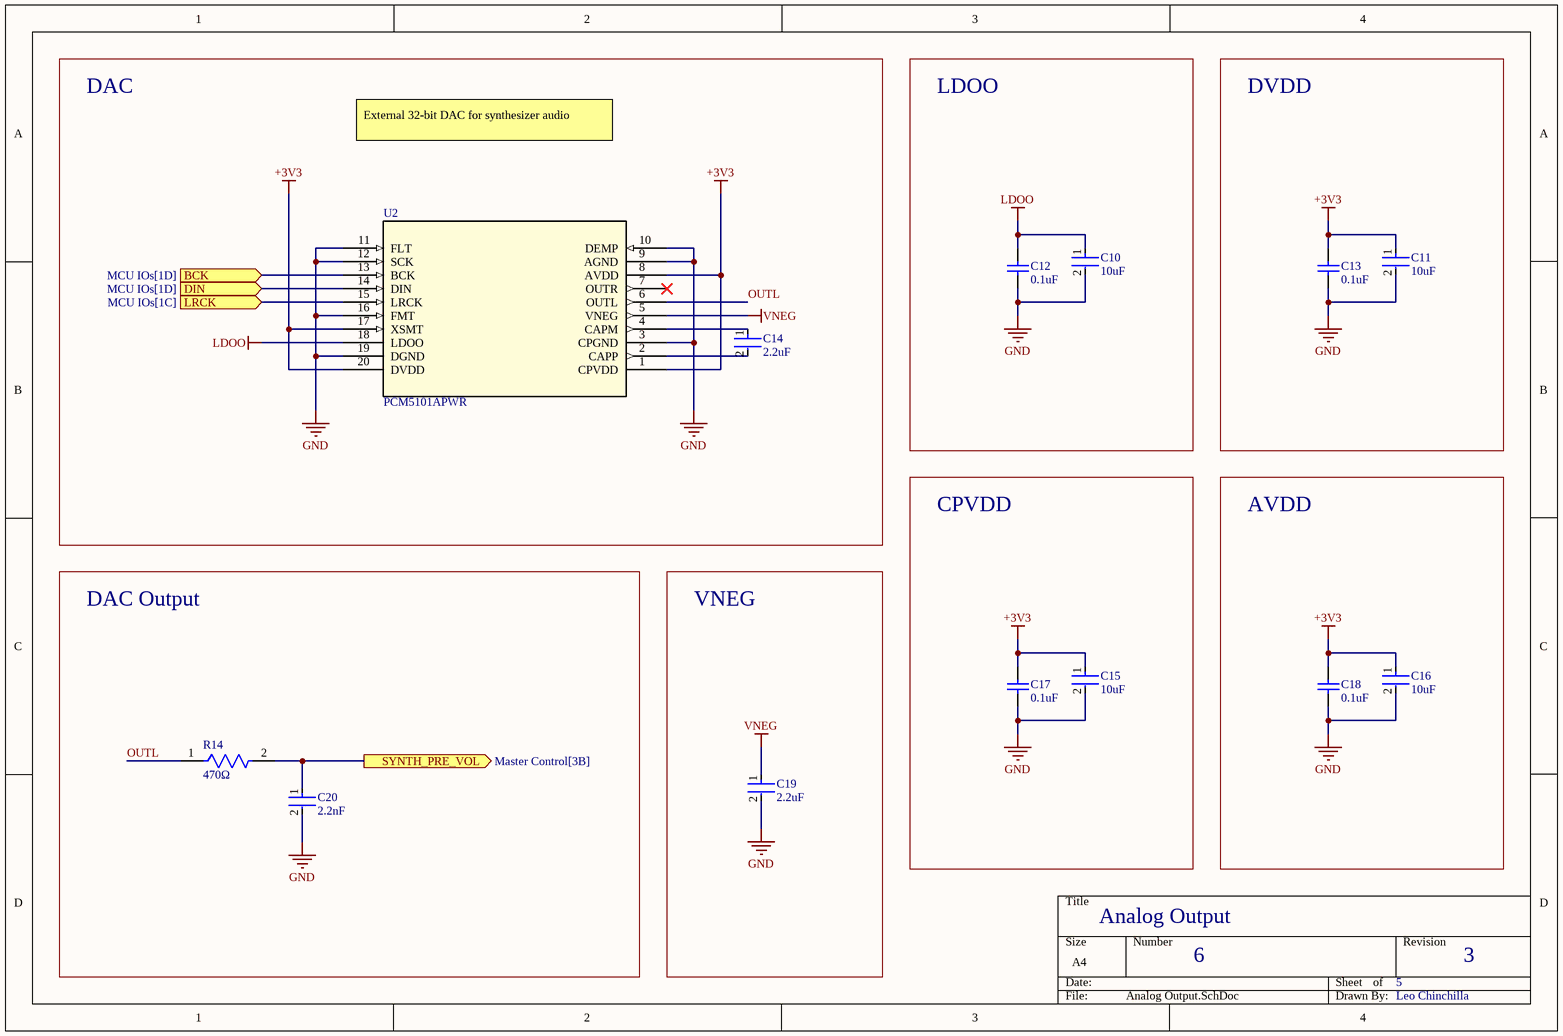
[diagram p4: Analog Output.SchDoc]

### Parts
(Parts that share a designator on the sheet are numbered #1, #2 ... from top to bottom, then left to right.)
C10  10uF  [FP-GRM188-0_2-IPC_A]
C11  10uF  [FP-GRM188-0_2-IPC_A]
C12  0.1uF  [CAPC1608X92X38LL15T08]
C13  0.1uF  [CAPC1608X92X38LL15T08]
C14#2  2.2uF  [FP-CC0603-DA-MFG]
C15  10uF  [FP-GRM188-0_2-IPC_A]
C16  10uF  [FP-GRM188-0_2-IPC_A]
C17  0.1uF  [CAPC1608X92X38LL15T08]
C18  0.1uF  [CAPC1608X92X38LL15T08]
C19  2.2uF  [FP-CC0603-DA-MFG]
C20  2.2nF  [FP-C0603C-CF-MFG]
R14#2  470Ω  [FP-RT0603-MFG]
U2  PCM5101APWR  [PW20]

### Blocks framed on the sheet
DAC: C14#2 U2
LDOO: C10 C12
DVDD: C11 C13
CPVDD: C15 C17
AVDD: C16 C18
DAC Output: C20 R14#2
VNEG: C19

### Ports
BCK (in, see MCU IOs[1D]), DIN (in, see MCU IOs[1D]), LRCK (in, see MCU IOs[1C]), SYNTH_PRE_VOL (out, see Master Control[3B])

### Nets
+3V3: C11.1 C13.2 C15.1 C16.1 C17.2 C18.2 U2.1(CPVDD) U2.8(AVDD) U2.17(XSMT) U2.20(DVDD)
GND: C10.2 C11.2 C12.1 C13.1 C15.2 C16.2 C17.1 C18.1 C19.2 C20.2 U2.3(CPGND) U2.9(AGND) U2.10(DEMP) U2.11(FLT) U2.12(SCK) U2.16(FMT) U2.19(DGND)
LDOO: C10.1 C12.2 U2.18(LDOO)
VNEG: C19.1 U2.5(VNEG)
OUTL: R14#2.1 U2.6(OUTL)
NetC14#2_1: C14#2.1 U2.4(CAPM)
NetC14#2_2: C14#2.2 U2.2(CAPP)
NetC20_1: C20.1 R14#2.2 ; port SYNTH_PRE_VOL
NetU2_13: U2.13(BCK) ; port BCK
NetU2_14: U2.14(DIN) ; port DIN
NetU2_15: U2.15(LRCK) ; port LRCK

Not connected (* = marked no-connect by the designer): U2 7(OUTR)*

### Notes on the sheet
- External 32-bit DAC for synthesizer audio

### Library data of the parts
C10 C11 C15 C16 = CMP-06035-045268-1: as C22 on sheet Board Power; Case/Package: 0603
C12 C13 C17 C18 = CMP-2006-00951-1: Manufacturer: Vishay; Part Number: VJ0603Y104KXJAR
C14#2 C19 = CMP-03422-001238-1: as C29 on sheet Master Control; Voltage: 16 V; Temperature Range High: +125°C; Digikey Description: CAP CER 2.2UF 16V X7R 0603; Temperature: -55°C to +125°C; Value: 2.2 uF; Lead Free: Yes; Capacitance: 2.2 uF; Package: CC0603-DA; ComponentLink2URL: http://www.yageo.com/documents/recent/UPY-GPHC_X7R_6.3V-to-50V_18.pdf; Device Class L1: Passive Components; Category: Cap; ComponentLink2Description: Datasheet; Mouser Description: Cap Ceramic 2.2uF 16V X7R 10% Pad SMD 0603 125C Automotive T/R; Device Class L2: Capacitors; RoHS: TRUE; Automotive: No; Voltage Rating: 16 V; Device Class L3: Ceramic Capacitors; Temperature Range Low: -55°C; Height: 0.9mm; Footprint Url: http://www.yageo.com/exep/pages/download/literatures/UPY-C_GEN_24.pdf; Temperature Characteristic: X7R; Octopart: https://octopart.com/cc0603krx7r7bb225-yageo-67146440
C20 = CMP-03020-015097-1: C0603 2,200 pF C0G 30ppm/°C 1.00% 200 V; Manufacturer: KEMET; Manufacturer Part Number: C0603C222F2GAC7411; Tolerance: 0.01; Automotive Grade: Grade 1; Material: Ceramic; Voltage Rating: 200 V; Temperature Range Low: -55°C; Temperature: -55°C to +125°C; ComponentLink2Description: Datasheet; ComponentLink2URL: https://api.kemet.com/component-edge/download/datasheet/C0603C100J5GACAUTO.pdf; Device Class L3: Ceramic Capacitors; Temperature Coefficient: 30ppm/°C; Device Class L1: Passive Components; Height: 0.87mm; Temperature Range High: +125°C; Category: Cap; Device Class L2: Capacitors; Package: C0603C-CF; RoHS: TRUE; Temperature Characteristic: C0G; Value: 2,200 pF; Automotive: Yes; Mouser Description: Multilayer Ceramic Capacitors MLCC - SMD/SMT 200volts 2.2nF 1% C0G; Lead Free: Yes; Octopart: https://octopart.com/c0603c222f2gac7411-kemet-104967403; Capacitance: 2,200 pF
R14#2 = CMP-03412-030448-1: RES SMD 470 OHM 0.25% 1/10W 0603; Manufacturer: Yageo; Manufacturer Part Number: RT0603CRE07470RL; Temperature Coefficient: 50 ppm/°C; Tolerance: 0.0025; Power Rating: 0.1W; Voltage Rating: 75V; Ipc Land Pattern Name: RESC16080X45; Device Class L2: Resistors; Resistance: 470Ω; Temperature Range Low: -55°C; Composition: Thin Film; Category: Res; Footprint Url: http://www.yageo.com/exep/pages/download/literatures/PYu-R_Mount_10.pdf; Lead Free: Yes; Digikey Description: RES SMD 470 OHM 0.25% 1/10W 0603; Package: RT0603; ComponentLink2Description: Datasheet; Octopart: https://octopart.com/rt0603cre07470rl-yageo-1250070; Height: 0.55mm; RoHS: TRUE; Temperature Range High: +155°C; Series: RT; Temperature: -55°C to +155°C; Device Class L1: Passive Components; Value: 470Ω; Automotive: No; Device Class L3: Chip SMD Resistors; ComponentLink2URL: http://www.yageo.com/documents/recent/PYu-RT_1-to-0.01_RoHS_L_9.pdf
U2 = PCM5101APWR: 2VRMS DirectPath&trade;, 106dB Audio Stereo DAC with 32-bit, 384kHz PCM Interface 20-TSSOP -25 to 85; Manufacturer_Name: Texas Instruments; Copyright: Copyright (C) 2025 Ultra Librarian. All rights reserved.; Manufacturer_Part_Number: PCM5101APWR; RefDes: RefDes; Type: Type

## Sheet MCU Power.SchDoc: MCU Power
size A4; SheetNumber: 4; SheetTotal: 5
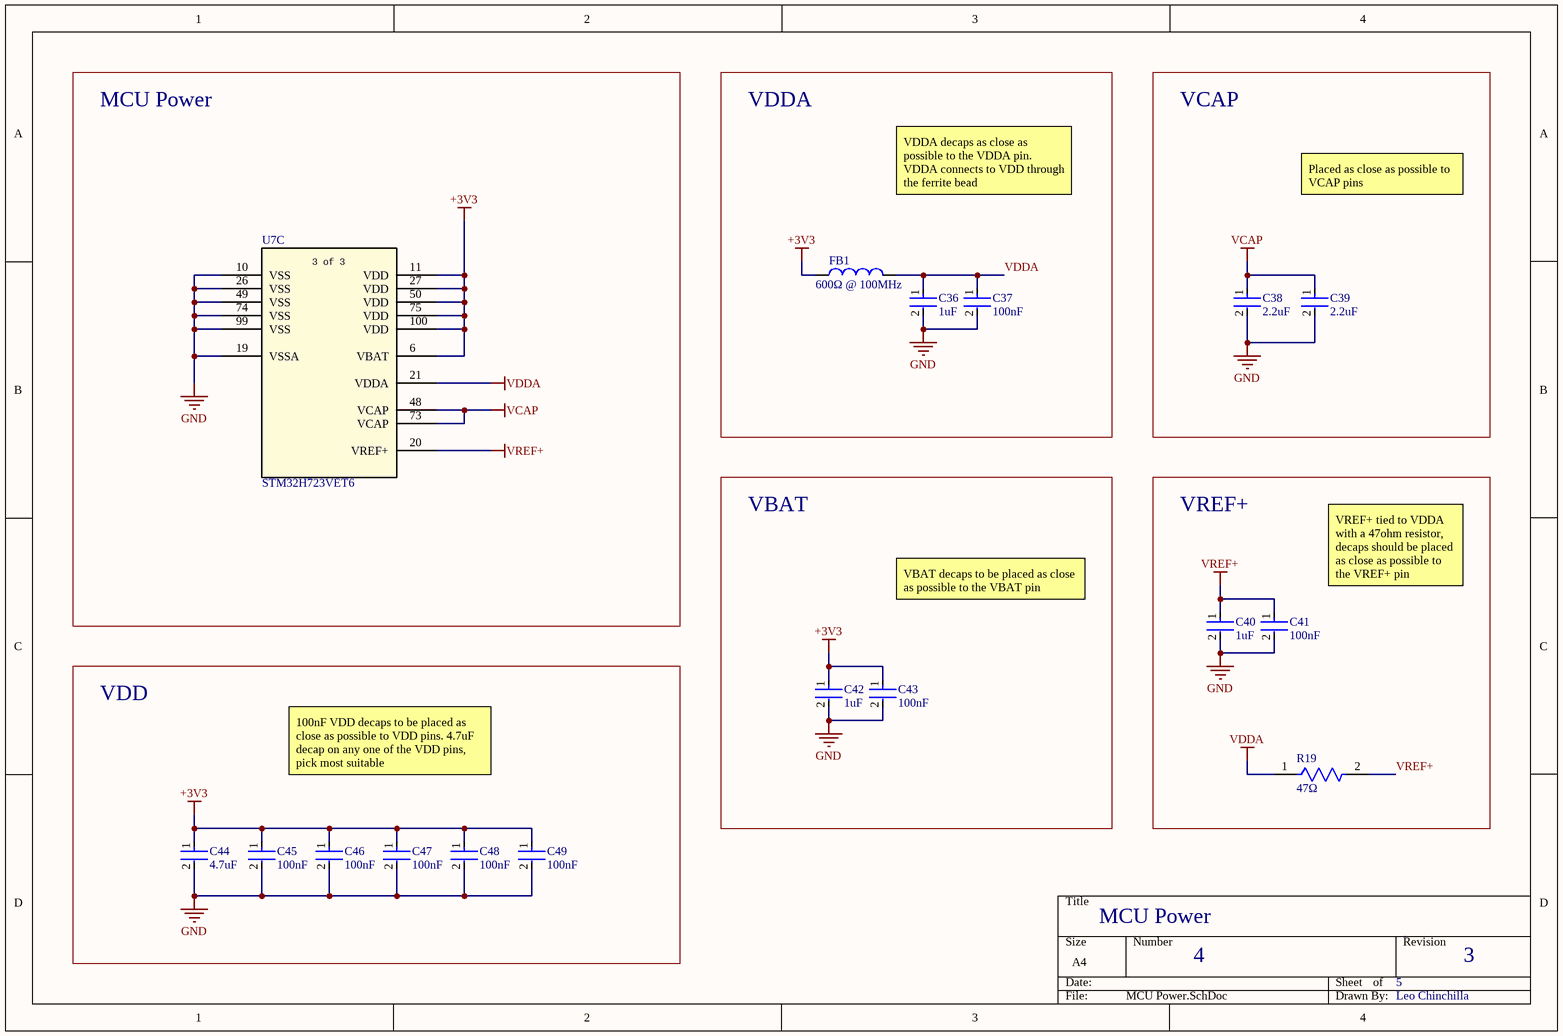
[diagram p5: MCU Power.SchDoc]

### Parts
(Parts that share a designator on the sheet are numbered #1, #2 ... from top to bottom, then left to right.)
C36  1uF  [FP-CC0603-DA-MFG]
C37  100nF  [FP-CC0603-DA-MFG]
C38  2.2uF  [FP-CL10-IPC_C]
C39  2.2uF  [FP-CL10-IPC_C]
C40  1uF  [FP-CC0603-DA-MFG]
C41  100nF  [FP-CC0603-DA-MFG]
C42  1uF  [FP-CC0603-DA-MFG]
C43  100nF  [FP-CC0603-DA-MFG]
C44  4.7uF  [FP-CC0603-DA-MFG]
C45  100nF  [FP-CC0603-DA-MFG]
C46  100nF  [FP-CC0603-DA-MFG]
C47  100nF  [FP-CC0603-DA-MFG]
C48  100nF  [FP-CC0603-DA-MFG]
C49  100nF  [FP-CC0603-DA-MFG]
FB1  600Ω @ 100MHz  [WE-MPSB_0805_L2W1.2H0.9]
R19#2  47Ω  [FP-RT0603-MFG]
U7  STM32H723VET6  [LQFP100_STM]  (part C of 3)

### Blocks framed on the sheet
MCU Power: U7
VDDA: C36 C37 FB1
VCAP: C38 C39
VBAT: C42 C43
VREF+: C40 C41 R19#2
VDD: C44-C49

### Nets
+3V3: C42.1 C43.1 C44.1 C45.1 C46.1 C47.1 C48.1 C49.1 FB1.1 U7.6(VBAT) U7.11(VDD) U7.27(VDD) U7.50(VDD) U7.75(VDD) U7.100(VDD)
GND: C36.2 C37.2 C38.2 C39.2 C40.2 C41.2 C42.2 C43.2 C44.2 C45.2 C46.2 C47.2 C48.2 C49.2 U7.10(VSS) U7.19(VSSA) U7.26(VSS) U7.49(VSS) U7.74(VSS) U7.99(VSS)
VCAP: C38.1 C39.1 U7.48(VCAP) U7.73(VCAP)
VDDA: C36.1 C37.1 FB1.2 R19#2.1 U7.21(VDDA)
VREF+: C40.1 C41.1 R19#2.2 U7.20(VREF+)

### Notes on the sheet
- VDDA decaps as close as possible to the VDDA pin. VDDA connects to VDD through the ferrite bead
- Placed as close as possible to VCAP pins
- VREF+ tied to VDDA with a 47ohm resistor, decaps should be placed as close as possible to the VREF+ pin
- VBAT decaps to be placed as close as possible to the VBAT pin
- 100nF VDD decaps to be placed as close as possible to VDD pins. 4.7uF decap on any one of the VDD pins, pick most suitable
- (in symbol STM32H723VET6, part C) 3 of 3

### Library data of the parts
C36 C40 C42 = CMP-2100-03598-2: as C24 on sheet Board Power; Value: 1 uF; ComponentLink2URL: http://www.yageo.com/documents/recent/UPY-GPHC_X7R_6.3V-to-50V_18.pdf; Temperature Range Low: -55°C; Temperature Range High: +125°C; Device Class L3: Ceramic Capacitors; Voltage: 25 V; Voltage Rating: 25 V; Capacitance: 1 uF; Mouser Description: 0603 1 uF 25 V ±10% Tolerance X7R SMT Multilayer Ceramic Capacitor; Footprint Url: http://www.yageo.com/exep/pages/download/literatures/UPY-C_GEN_24.pdf; Height: 0.9mm; Digikey Description: CAP CER 1UF 25V X7R 0603; Temperature: -55°C to +125°C; ComponentLink2Description: Datasheet; Device Class L2: Capacitors; Category: Cap; Lead Free: Yes; Octopart: https://octopart.com/cc0603krx7r8bb105-yageo-24490981; RoHS: TRUE; Package: CC0603-DA; Device Class L1: Passive Components; Temperature Characteristic: X7R; Automotive: No
C37 C41 C43 C45-C49 = CMP-03422-000081-1: as C21 on sheet Board Power; Package: CC0603-DA; Capacitance: 100 nF; Device Class L2: Capacitors; Temperature Range High: +125°C; Automotive: No; Temperature Range Low: -55°C; Value: 100 nF; Device Class L1: Passive Components; Height: 0.9mm; RoHS: TRUE; Mouser Description: Multilayer Ceramic Capacitors MLCC - SMD/SMT 100nF 25V X7R 10%; Temperature Characteristic: X7R; Footprint Url: http://www.yageo.com/exep/pages/download/literatures/UPY-C_GEN_24.pdf; Octopart: https://octopart.com/cc0603kpx7r8bb104-yageo-12885111; Category: Cap; ComponentLink2Description: Datasheet; Voltage Rating: 25 V; Temperature: -55°C to +125°C; Device Class L3: Ceramic Capacitors; ComponentLink2URL: http://www.yageo.com/documents/recent/UPY-GPHC_X7R_6.3V-to-50V_18.pdf; Lead Free: Yes
C38 C39 = CMP-13271-002004-1: Cap Ceramic 2.2uF 6.3V X7R ±10% Pad SMD 0603 +125°C T/R; Mount: Surface Mount; Package Quantity: 1; Width: 0.031inch; Min Operating Temperature: -55°C; Length: 0.063inch; Max Operating Temperature: 125°C; Radiation Hardening: No; Height: 0.8mm; Dielectric: X7R; Depth: 0.8mm; Packaging: Tape and Reel; Case/Package: 0603; Capacitance: 2.2uF; Case Code (Imperial): 0603; Tolerance: 10%; Voltage Rating: 6.3V; Case Code (Metric): 1608; Thickness: 0.035inch
C44 = CMP-03422-001217-1: as C27 on sheet Board Power; Device Class L1: Passive Components; Temperature: -55°C to +125°C; Value: 4.7 uF; RoHS: TRUE; Temperature Range High: +125°C; Automotive: No; Lead Free: Yes; Digikey Description: CAP CER 4.7UF 25V X5R 0603; Category: Cap; Temperature Characteristic: X5R; Package: CC0603-DA; Device Class L2: Capacitors; Temperature Range Low: -55°C; Voltage Rating: 25 V; Capacitance: 4.7 uF; ComponentLink2URL: http://www.yageo.com/documents/recent/UPY-GPHC_X7R_6.3V-to-50V_18.pdf; Octopart: https://octopart.com/cc0603krx5r8bb475-yageo-77825350; Footprint Url: http://www.yageo.com/exep/pages/download/literatures/UPY-C_GEN_24.pdf; Device Class L3: Ceramic Capacitors; ComponentLink2Description: Datasheet; Voltage: 25 V; Height: 0.9mm
FB1 = CMP-03913-52738340-1: 74279220601 Ferrite Beads Multi-Layer High Current 600Ohm 25% 100MHz 2.1A 0.08Ohm DCR 0805 Automotive T/R; DC Resistance (DCR): 43mΩ; Number of Lines: 1; NexarPartId: 52738340; Current Rating: 2.1A; Termination: SMD/SMT; Max Current Rating: 2.1A; Min Operating Temperature: -55°C; Case Code (Imperial): 0805; Case Code (Metric): 2012; Case/Package: 0805; Packaging: Tape & Reel (TR); Impedance: 600Ω; Max Operating Temperature: 125°C; Height: 900µm; Test Frequency: 100MHz; REACH SVHC: Unknown; RoHS: Compliant; Width: 1.2mm; Weight: 5.499807mg; Length: 2mm; Tolerance: 25%; Max DC Current: 2.1A; Mount: Surface Mount
R19#2 = CMP-03412-031197-1: RES SMD 47 OHM 0.1% 1/10W 0603; Manufacturer: Yageo; Manufacturer Part Number: RT0603BRE0747RL; Tolerance: 0.001; Power Rating: 0.1W; Voltage Rating: 75V; Temperature Coefficient: 50 ppm/°C; Device Class L2: Resistors; Temperature Range High: +155°C; Series: RT; ComponentLink2URL: http://www.yageo.com/documents/recent/PYu-RT_1-to-0.01_RoHS_L_9.pdf; Composition: Thin Film; Lead Free: Yes; Automotive: No; RoHS: TRUE; Device Class L1: Passive Components; Category: Res; Resistance: 47Ω; Value: 47Ω; Temperature Range Low: -55°C; Footprint Url: http://www.yageo.com/exep/pages/download/literatures/PYu-R_Mount_10.pdf; Device Class L3: Chip SMD Resistors; Temperature: -55°C to +155°C; Octopart: https://octopart.com/rt0603bre0747rl-yageo-1447540; ComponentLink2Description: Datasheet; Package: RT0603; Ipc Land Pattern Name: RESC16080X45; Digikey Description: RES SMD 47 OHM 0.1% 1/10W 0603; Height: 0.55mm
U7 = STM32H723VET6: High-performance and DSP with DP-FPU, Arm Cortex-M7 MCU with 512 Kbytes Flash, 564 Kbytes RAM, 550 MHz CPU, L1 cache, external memory interface, subset of peripherals; Manufacturer_Name: STMicroelectronics; Copyright: Copyright (C) 2026 Ultra Librarian. All rights reserved.; Manufacturer_Part_Number: STM32H723VET6; RefDes: RefDes; Type: Type